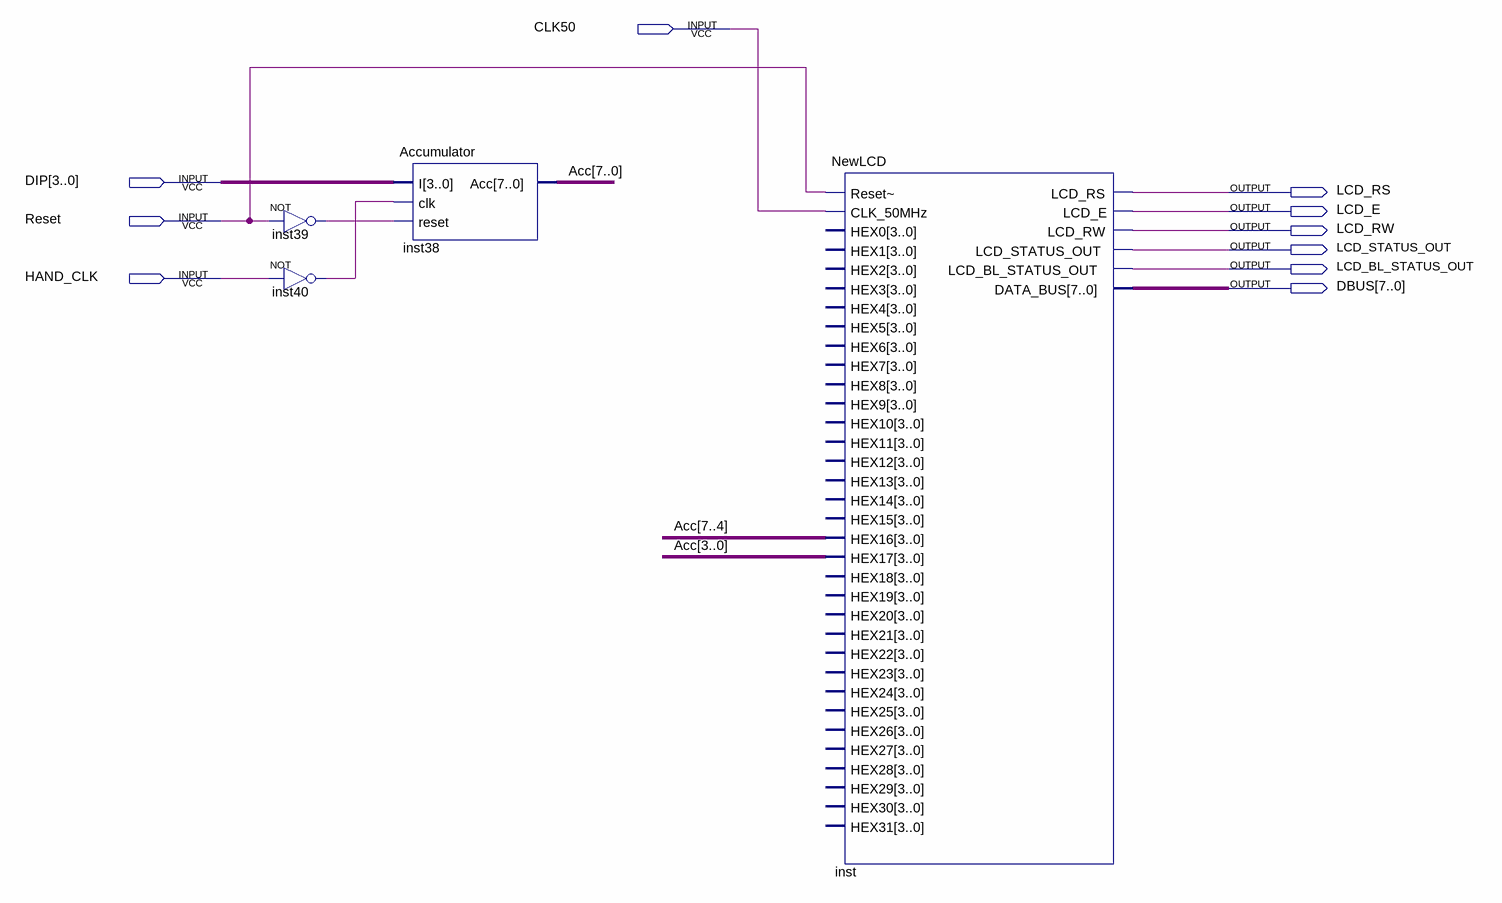
[diagram p0: schematic sheet]
// Quartus schematic AccBoard.bdf as structural Verilog: 4 symbols, 10 pins
module AccBoard (
  input  CLK50,
  input  [3:0] DIP,
  input  Reset,
  input  HAND_CLK,
  output LCD_RS,
  output LCD_E,
  output LCD_RW,
  output LCD_STATUS_OUT,
  output LCD_BL_STATUS_OUT,
  output [7:0] DBUS
);

  wire inst39_out, inst40_out;
  wire [7:0] Acc;

  not inst39 (inst39_out, Reset);
  not inst40 (inst40_out, HAND_CLK);
  Accumulator inst38 (.I(DIP), .clk(inst40_out), .reset(inst39_out), .Acc(Acc));
  NewLCD inst (
    .\Reset~ (Reset), .CLK_50MHz(CLK50), .HEX16(Acc[7:4]), .HEX17(Acc[3:0]), .LCD_RS(LCD_RS), .LCD_E(LCD_E),
    .LCD_RW(LCD_RW), .LCD_STATUS_OUT(LCD_STATUS_OUT), .LCD_BL_STATUS_OUT(LCD_BL_STATUS_OUT), .DATA_BUS(DBUS));  // open: HEX0, HEX1, HEX2, HEX3, HEX4, HEX5, HEX6, HEX7, HEX8, HEX9, HEX10, HEX11, HEX12, HEX13, HEX14, HEX15, HEX18, HEX19, HEX20, HEX21, HEX22, HEX23, HEX24, HEX25, HEX26, HEX27, HEX28, HEX29, HEX30, HEX31
endmodule
